# EAGLE design wireless (EAGLE 4.16)
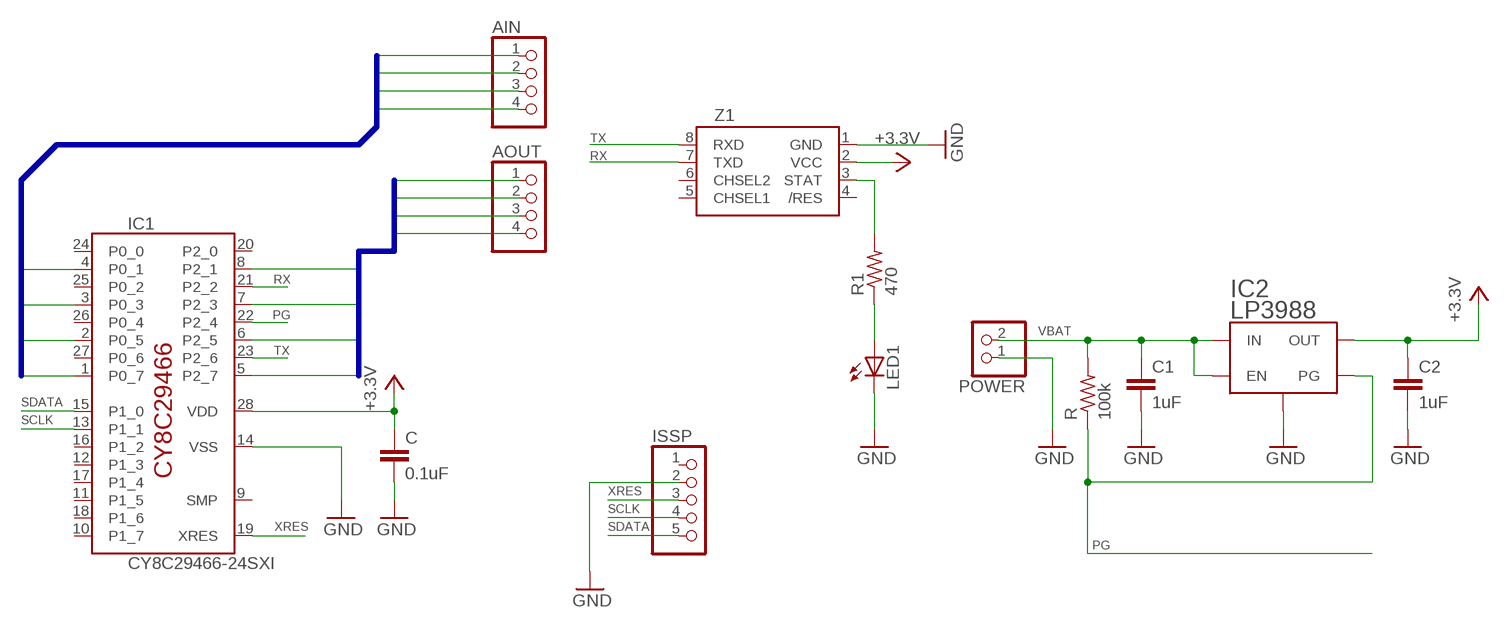
[diagram p0: schematic, sheet 1]

## Parts
AIN  PINHD-1X4  [1X04]
AOUT  PINHD-1X4  [1X04]
C  0.1uF  C-EUC1608  [C1608]
C1  1uF  C-EUC1608  [C1608]
C2  1uF  C-EUC1608  [C1608]
IC1  CY8C29466-24SXI  [SOIC28]
IC2  LP3988  [SOT-23-5]
ISSP  PINHD-1X5  [1X05]
LED1  LEDCHIP-LED0603  [CHIP-LED0603]
POWER  PINHD-1X2  [1X02]
R  100k  R-US_R0603  [R0603]
R1  470  R-US_R0603  [R0603]
Z1  ZIG-100B  [ZIG-100B]

## Nets
+3V: C2.1 C.1 IC1.28(VDD) IC2.P$5(OUT) Z1.2(VCC) ; supply symbol labelled +3.3V
AOUT0: AOUT.1 IC1.5(P2_7)
AOUT1: AOUT.2 IC1.6(P2_5)
AOUT2: AOUT.3 IC1.7(P2_3)
AOUT3: AOUT.4 IC1.8(P2_1)
DIN0: AIN.1 IC1.1(P0_7)
DIN1: AIN.2 IC1.2(P0_5)
DIN2: AIN.3 IC1.3(P0_3)
DIN3: AIN.4 IC1.4(P0_1)
GND: C1.2 C2.2 C.2 IC1.14(VSS) IC2.P$2(GND) ISSP.2 LED1.C POWER.1 Z1.1(GND)
N$1: R1.2 Z1.3(STAT)
N$2: LED1.A R1.1
PG: IC1.22(P2_4) IC2.P$4(PG) R.1
RX: IC1.21(P2_2) Z1.7(TXD)
SCLK: IC1.13(P1_1) ISSP.4
SDATA: IC1.15(P1_0) ISSP.5
TX: IC1.23(P2_6) Z1.8(RXD)
VBAT: C1.1 IC2.P$1(IN) IC2.P$3(EN) POWER.2 R.2
XRES: IC1.19(XRES) ISSP.3
Unconnected: IC1.9(SMP) IC1.10(P1_7) IC1.11(P1_5) IC1.12(P1_3) IC1.16(P1_2) IC1.17(P1_4) IC1.18(P1_6) IC1.20(P2_0) IC1.24(P0_0) IC1.25(P0_2) IC1.26(P0_4) IC1.27(P0_6) ISSP.1 Z1.4(/RES) Z1.5(CHSEL1) Z1.6(CHSEL2)

## Buses
DIN[0..3]
AOUT[0..3]

## Library data of the parts
AIN AOUT = pinhead:PINHD-1X4: PIN HEADER
C C1 C2 = rcl:C-EU: CAPACITOR, European symbol
IC1 = cypress_psoc:CY8C29466-24*: PSoC Mixed-Signal Array CY8C29466-24PXI (DIP) CY8C29466-24SXI (SOIC) CY8C29466-24PVXI (SSOP)
IC2 = v-regulator_lp3988:LP3988
ISSP = pinhead:PINHD-1X5: PIN HEADER
LED1 = led:LED: LED OSRAM: - CHIPLED LG R971, LG N971, LY N971, LG Q971, LY Q971, LO R971, LY R971 LH N974, LH R974 LS Q976, LO Q976, LY Q976 LO Q996 - Hyper CHIPLED LW Q18S LB Q993, LB Q99A, LB R99A - SideLED LS A670, LO A670, LY A670, LG A670, LP A670 LB A673, LV A673, LT A673, LW A673 LH A674 LY A675 LS A676, LA A676, LO A676, LY A676, LW A676 LS A679, LY A679, LG A679 - Hyper Micro SIDELED® LS Y876, LA Y876, LO Y876, LY Y876 LT Y87S - SmartLED LW L88C, LW L88S LB L89C, LB L89S, LG L890 LS L89K, LO L89K, LY L89K LS L896, LA L896, LO L896, LY L896 - TOPLED LS T670, LO T670, LY T670, LG T670, LP T670 LSG T670, LSP T670, LSY T670, LOP T670, LYG T670 LG T671, LOG T671, LSG T671 LB T673, LV T673, LT T673, LW T673 LH T674 LS T676, LA T676, LO T676, LY T676, LB T676, LH T676, LSB T676, LW T676 LB T67C, LV T67C, LT T67C, LS T67K, LO T67K, LY T67K, LW E67C LS E67B, LA E67B, LO E67B, LY E67B, LB E67C, LV E67C, LT E67C LW T67C LS T679, LY T679, LG T679 LS T770, LO T770, LY T770, LG T770, LP T770 LB T773, LV T773, LT T773, LW T773 LH T774 LS E675, LA E675, LY E675, LS T675 LS T776, LA T776, LO T776, LY T776, LB T776 LHGB T686 LT T68C, LB T68C - Hyper Mini TOPLED® LB M676 - Mini TOPLED Santana® LG M470 LS M47K, LO M47K, LY M47K Source: http://www.osram.convergy.de - LUMILED® LXK2-PW12-R00, LXK2-PW12-S00, LXK2-PW14-U00, LXK2-PW14-V00 LXK2-PM12-R00, LXK2-PM12-S00, LXK2-PM14-U00 LXK2-PE12-Q00, LXK2-PE12-R00, LXK2-PE12-S00, LXK2-PE14-T00, LXK2-PE14-U00 LXK2-PB12-K00, LXK2-PB12-L00, LXK2-PB12-M00, LXK2-PB14-N00, LXK2-PB14-P00, LXK2-PB14-Q00 LXK2-PR12-L00, LXK2-PR12-M00, LXK2-PR14-Q00, LXK2-PR14-R00 LXK2-PD12-Q00, LXK2-PD12-R00, LXK2-PD12-S00 LXK2-PH12-R00, LXK2-PH12-S00 LXK2-PL12-P00, LXK2-PL12-Q00, LXK2-PL12-R00 Source: www.luxeon.com
POWER = pinhead:PINHD-1X2: PIN HEADER
R R1 = rcl:R-US_: RESISTOR, American symbol
Z1 = besttechnology:ZIG-100B

## Board
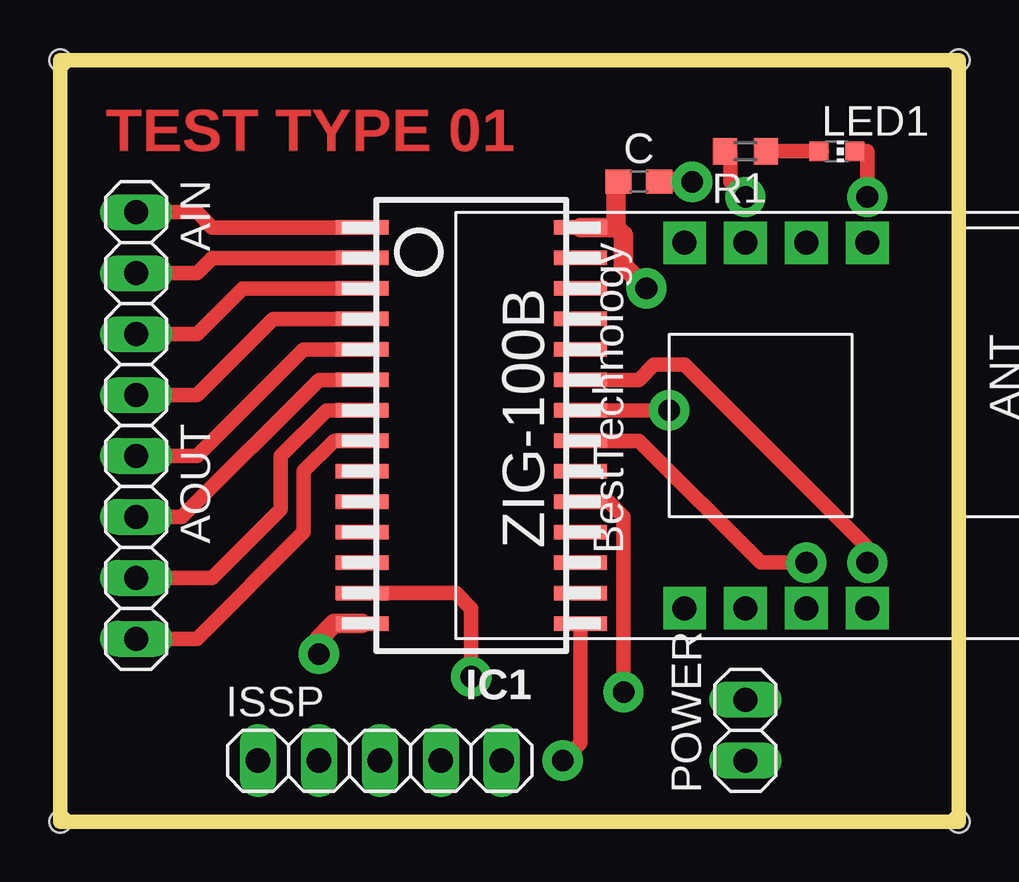
[diagram p1: board, top side]
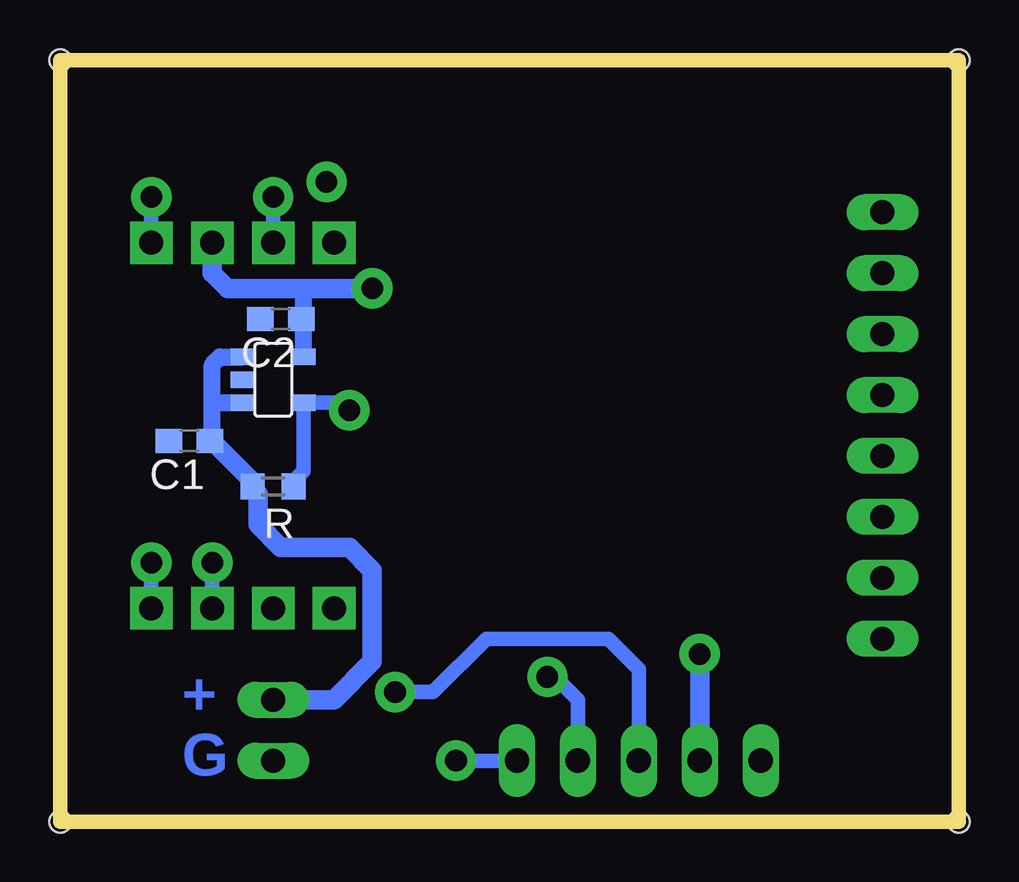
[diagram p2: board, bottom side, seen from below]

Size 37.46 x 31.75 mm. Coordinates in mm from the lower left corner, seen from the top.
Outline: 0,0 0,31.75 37.46,31.75 37.46,0 0,0
Copper layers (1*16): Top 0.035mm / dielectric 1.5mm / Bottom 0.035mm
Design rules "10mils": minimum track width 10mil, minimum drill 24mil, track to track 10mil, track to pad 10mil, pad to pad 10mil, via to via 10mil, smd to smd 10mil, copper to edge 40mil, drill to drill 10mil, minimum pad ring 10mil, minimum via ring 8mil, stop-mask expansion 0mil, vias tented up to drill 0mil, thermal gap 10mil
Holes 0.9 mm at 0,31.75 37.46,31.75 37.46,0 0,0

### Footprints (pad centres in the part's own frame; a part is rotated, then mirrored left to right if it is on the bottom)
1X04 = drill 1 long: 1 -3.81,0; 2 -1.27,0; 3 1.27,0; 4 3.81,0
C1608 = smd 1.1 x 1: 1 -0.85,0; 2 0.85,0
SOIC28 = smd 0.6 x 2.2: 1 8.89,4.548; 2 7.62,4.548; 3 6.35,4.548; 4 5.08,4.548; 5 3.81,4.548; 6 2.54,4.548; 7 1.27,4.548; 8 0,4.548; 9 -1.27,4.548; 10 -2.54,4.548; 11 -3.81,4.548; 12 -5.08,4.548; 13 -6.35,4.548; 14 -7.62,4.548; 15 -7.62,-4.548; 16 -6.35,-4.548; 17 -5.08,-4.548; 18 -3.81,-4.548; 19 -2.54,-4.548; 20 -1.27,-4.548; 21 0,-4.548; 22 1.27,-4.548; 23 2.54,-4.548; 24 3.81,-4.548; 25 5.08,-4.548; 26 6.35,-4.548; 27 7.62,-4.548; 28 8.89,-4.548
SOT-23-5 = smd 0.686 x 0.991: P$1 -0.953,-1.27; P$2 0,-1.27; P$3 0.953,-1.27; P$4 0.953,1.27; P$5 -0.953,1.27
1X05 = drill 1.016 long: 1 -5.08,0; 2 -2.54,0; 3 0,0; 4 2.54,0; 5 5.08,0
CHIP-LED0603 = smd 0.8 x 0.8: A 0,-0.75; C 0,0.75
1X02 = drill 1 long: 1 -1.27,0; 2 1.27,0
R0603 = smd 1 x 1.1: 1 -0.85,0; 2 0.85,0
ZIG-100B = drill 1 pad 1.778 square: 1 -7.62,3.81; 2 -7.62,1.27; 3 -7.62,-1.27; 4 -7.62,-3.81; 5 7.62,-3.81; 6 7.62,-1.27; 7 7.62,1.27; 8 7.62,3.81

### Placement (x,y rotation side)
AIN  3.17,21.59 270 top
AOUT  3.17,11.43 270 top
C  24.13,26.67 0 top
C1  32.07,15.88 180 bottom
C2  28.26,20.95 180 bottom
IC1  17.15,15.88 90 top
IC2  28.58,18.41 270 bottom
ISSP  13.33,2.54 0 top
LED1  32.38,27.94 270 top
POWER  28.58,3.81 90 top
R  28.58,13.97 180 bottom
R1  28.58,27.94 180 top
Z1  29.85,16.51 270 top

### Tracks (layer width: path | path; a pad name or v marks a point on that pad's centre or on a via)
+3V  (via drill 0.9 pad 1.68)
  Top 0.61: 23.18,26.67 C.1
  Top 0.813: 23.18,24.77 IC1.28 | 23.18,24.77 23.5,24.45 23.5,23.18 v24.45,22.23 | 23.18,24.77 23.18,26.67
  Bottom 0.61: 27.31,20.95 C2.1
  Bottom 0.711: IC2.P$5 27.31,20.95 27.31,22.23
  Bottom 0.813: v24.45,22.23 27.31,22.23 30.48,22.23 31.12,22.86 Z1.2
AOUT0
  Top 0.61: IC1.5 10.16,19.68 5.71,15.24 AOUT.1
AOUT1
  Top 0.61: IC1.6 10.79,18.41 5.08,12.7 AOUT.2
AOUT2
  Top 0.61: IC1.7 11.11,17.14 9.21,15.24 9.21,13.02 6.35,10.16 AOUT.3
AOUT3
  Top 0.61: AOUT.4 5.71,7.62 10.16,12.06 10.16,14.61 11.43,15.88 IC1.8
DIN0
  Top 0.61: IC1.1 6.35,24.77 5.71,25.4 AIN.1
DIN1
  Top 0.61: IC1.2 6.35,23.5 5.71,22.86 AIN.2
DIN2
  Top 0.61: IC1.3 7.62,22.23 5.71,20.32 AIN.3
DIN3
  Top 0.61: IC1.4 8.89,20.95 5.71,17.78 AIN.4
GND  (via drill 0.9 pad 1.68)
  Top 0.61: LED1.C 33.66,27.94 v33.66,26.04
  Top 0.813: IC1.14 11.43,8.26 10.79,7.62 v10.79,6.99 | C.2 v26.35,26.67
  Bottom 0.61: Z1.1 v33.66,26.04
  Bottom 0.813: ISSP.2 v10.79,6.99
N$1  (via drill 0.9 pad 1.68)
  Top 0.61: v28.58,26.04 27.94,26.67 27.94,27.94 R1.2
  Bottom 0.61: Z1.3 v28.58,26.04
N$2
  Top 0.61: 31.75,27.94 LED1.A R1.1
PG  (via drill 0.9 pad 1.68)
  Top 0.61: 21.59,17.14 IC1.22 v25.4,17.14
  Bottom 0.61: v25.4,17.14 25.72,17.46 IC2.P$4 27.31,14.61 27.94,13.97 R.1
RX  (via drill 0.9 pad 1.68)
  Top 0.61: IC1.21 24.13,15.88 29.21,10.79 v31.12,10.79
  Bottom 0.61: v31.12,10.79 Z1.7
SCLK  (via drill 0.9 pad 1.68)
  Top 0.61: IC1.13 16.51,9.53 17.15,8.89 v17.15,6.03
  Bottom 0.61: v17.15,6.03 16.83,6.03 15.88,5.08 ISSP.4
SDATA  (via drill 0.9 pad 1.68)
  Top 0.61: IC1.15 21.69,3.28 v20.96,2.54
  Bottom 0.61: ISSP.5 v20.96,2.54
TX  (via drill 0.9 pad 1.68)
  Top 0.61: IC1.23 24.13,18.41 24.77,19.05 26.04,19.05 33.66,11.43 v33.66,10.79
  Bottom 0.61: v33.66,10.79 Z1.8
VBAT
  Bottom 0.61: 29.21,13.65 29.43,13.87 R.2 29.43,14.19 | 31.12,15.88 C1.1
  Bottom 0.711: IC2.P$1 30.8,19.37 31.12,19.05 31.12,17.46 | 31.12,15.88 31.12,17.46 | 31.12,17.46 IC2.P$3
  Bottom 0.813: 29.21,13.65 29.21,12.38 28.26,11.43 25.4,11.43 24.45,10.48 24.45,6.67 26.04,5.08 POWER.2 | 29.43,14.19 31.12,15.88
XRES  (via drill 0.9 pad 1.68)
  Top 0.61: IC1.19 22.86,13.34 23.5,12.7 v23.5,5.4
  Bottom 0.61: v23.5,5.4 21.91,5.4 19.69,7.62 14.61,7.62 13.33,6.35 ISSP.3

### Text on the board
Top: TEST TYPE 01
Bottom: + | G